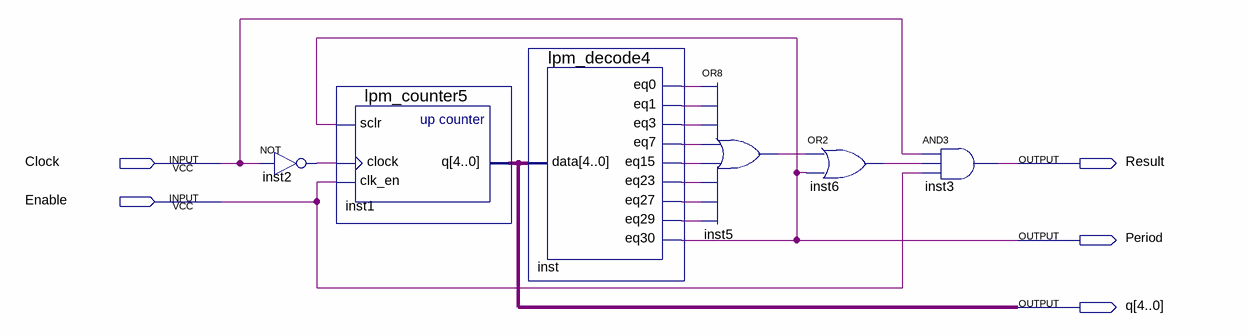
[diagram p0: schematic sheet]
// Quartus schematic counter_decoder.bdf as structural Verilog: 6 symbols, 5 pins
module counter_decoder (
  input  Clock,
  input  Enable,
  output Result,
  output Period,
  output [4:0] q
);

  wire inst2_out, inst5_out, inst6_out, inst_eq0, inst_eq1, inst_eq3, inst_eq7, inst_eq15, inst_eq23,
       inst_eq27, inst_eq29;

  not inst2 (inst2_out, Clock);
  lpm_counter5 inst1 (.sclr(Period), .clock(inst2_out), .clk_en(Enable), .q(q));
  lpm_decode4 inst (
    .data(q), .eq0(inst_eq0), .eq1(inst_eq1), .eq3(inst_eq3), .eq7(inst_eq7), .eq15(inst_eq15),
    .eq23(inst_eq23), .eq27(inst_eq27), .eq29(inst_eq29), .eq30(Period));
  or inst5 (inst5_out, inst_eq0, inst_eq1, inst_eq3, inst_eq7, inst_eq15, inst_eq23, inst_eq27, inst_eq29);
  or inst6 (inst6_out, inst5_out, Period);
  and inst3 (Result, Clock, inst6_out, Enable);
endmodule
